# Altium schematic sheet speaker.SchDoc
size Letter
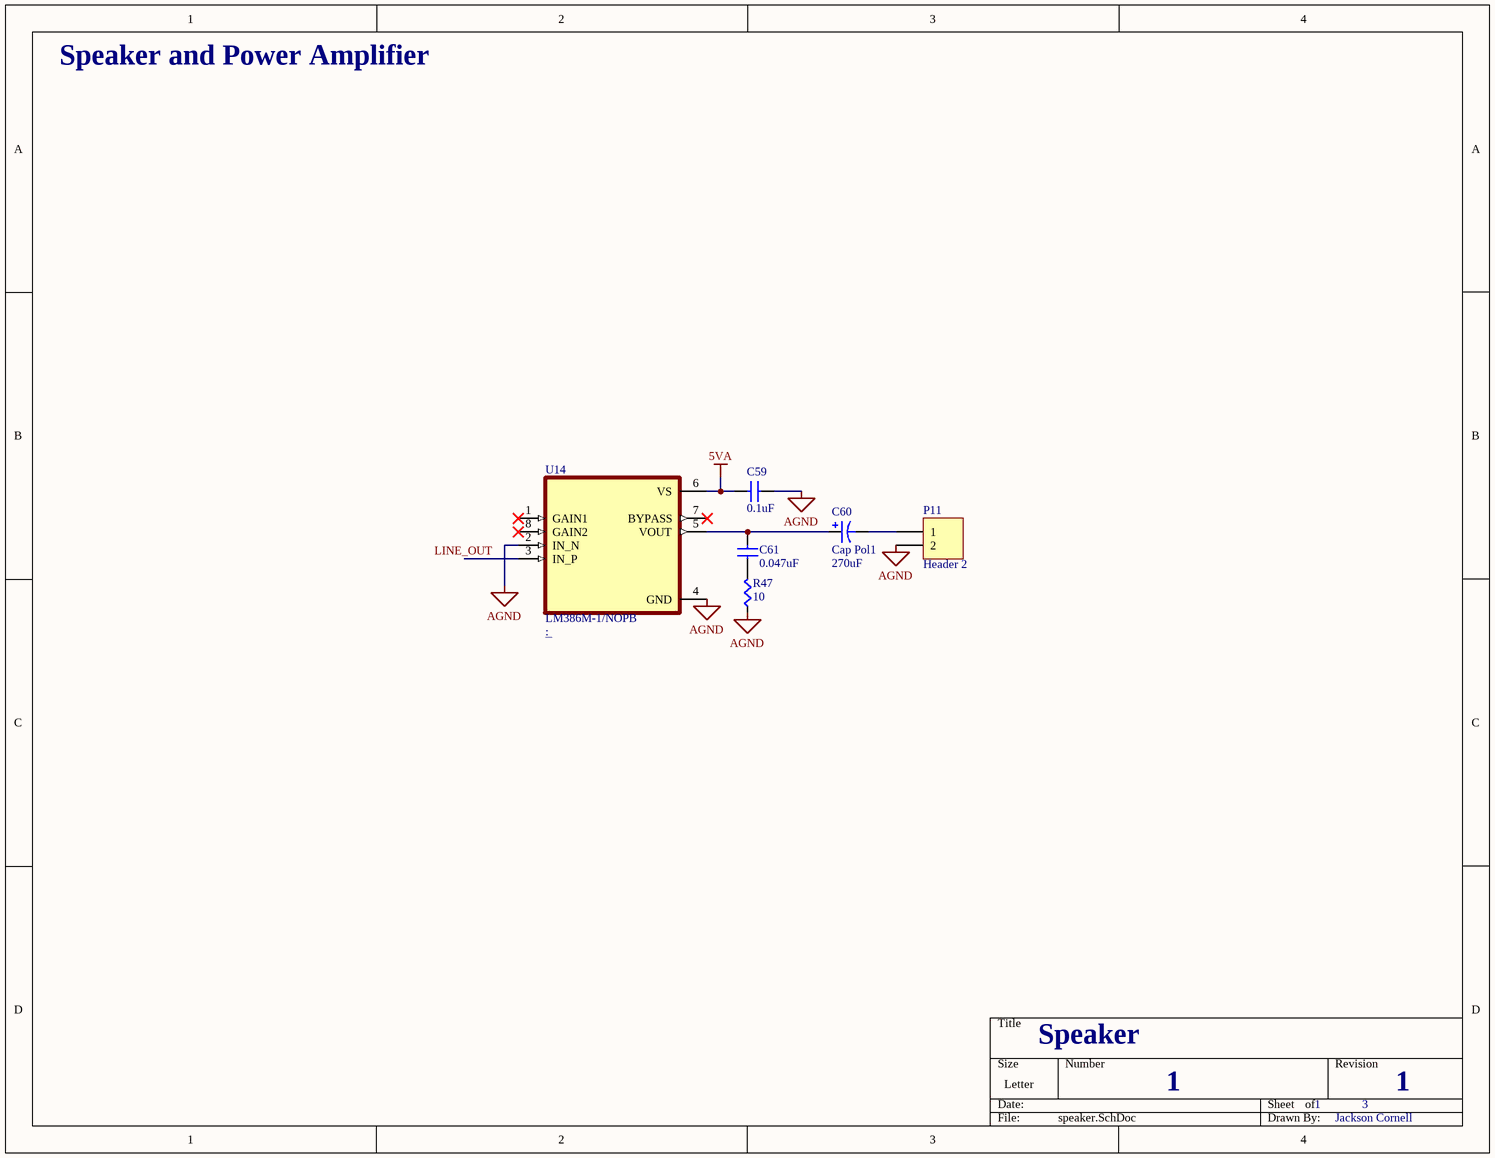
[diagram p0: speaker.SchDoc]

## Parts
C59  value 0.1uF  [CAPC0805]  (hidden comment: Cap)
C60  Cap Pol1  value 270uF  [CAPC0805]
C61  value 0.047uF  [CAPC0805]  (hidden comment: Cap)
P11  Header 2  [HDR1X2]
R47  value 10  [RES0805]  (hidden comment: Res)
U14  LM386M-1/NOPB  [SOIC127P599X175-8N]

## Nets
5VA: C59.2(B) U14.6(VS)
AGND: C59.1(A) P11.2 R47.2(B) U14.2(IN_N) U14.4(GND)
LINE_OUT: U14.3(IN_P)
NetC60_1: C60.1 C61.1(A) U14.5(VOUT)
NetC60_2: C60.2 P11.1
NetC61_2: C61.2(B) R47.1(A)

Not connected (* = marked no-connect by the designer): U14 1(GAIN1)* 7(BYPASS)* 8(GAIN2)*

## Notes on the sheet
- Speaker and Power Amplifier
- Speaker
- 1
- 3
- Jackson Cornell

## Library data of the parts
C60 = Cap Pol1: Polarized Capacitor (Radial); Published: 8-Jun-2000; LatestRevisionDate: 17-Jul-2002; LatestRevisionNote: Re-released for DXP Platform.; PackageReference: RB7.6-15; Publisher: Altium Limited; PackageDescription: Polarized Capacitor (Radial); 2 Leads
P11 = Header 2: Header, 2-Pin; LatestRevisionDate: 17-Jul-2002; LatestRevisionNote: Re-released for DXP Platform.; Publisher: Altium Limited
U14 = LM386M-1/NOPB: Wide Input Voltage Low Power Audio Amplifier with Internal Gain; MF: Texas Instruments; SnapEDA_Link: https://www.snapeda.com/parts/LM386M-1/Texas%20Instruments/view-part/2583261/?ref=snap; Availability: Unavailable; Package: SOIC-8 Texas Instruments; Price: None; MP: LM386M-1; Value: *
C59 C61 = Cap: Supplier 1: Digi-Key; Supplier Part Number 1: 1276-1000-1-ND
R47 = Res: Supplier 1: Digi-Key; Supplier Part Number 1: RMCF0603JT10K0CT-ND